# Altium project Kasli-DIOT.PrjPCB (part 4 of 7)

## Sheet FPGAGTP.SchDoc: Kasli-DIOT
size 420 x 297 mm; EDA_Number: ARTIQ; Projet: ARTIQ/SINARA; Author: G.Kasprowicz; CompanyName: WUT ISE; DrawnBy: F.Świtakowski; Organization: WUT ISE; Address1: PW ISE; Address2: Nowowiejska 15/19 00-665 Warsaw; Address3: gkasprow@gmail.com; DocumentNumber: 2; Revision: 1.0; SheetNumber: 3; SheetTotal: 16; ModifiedBy: -; CheckedDate: -; Title2: FPGAGTP; DivGrp: WUT ISE; Designer: F.Świtakowski; ModifiedDate: -; ProjectName: Sensor Box
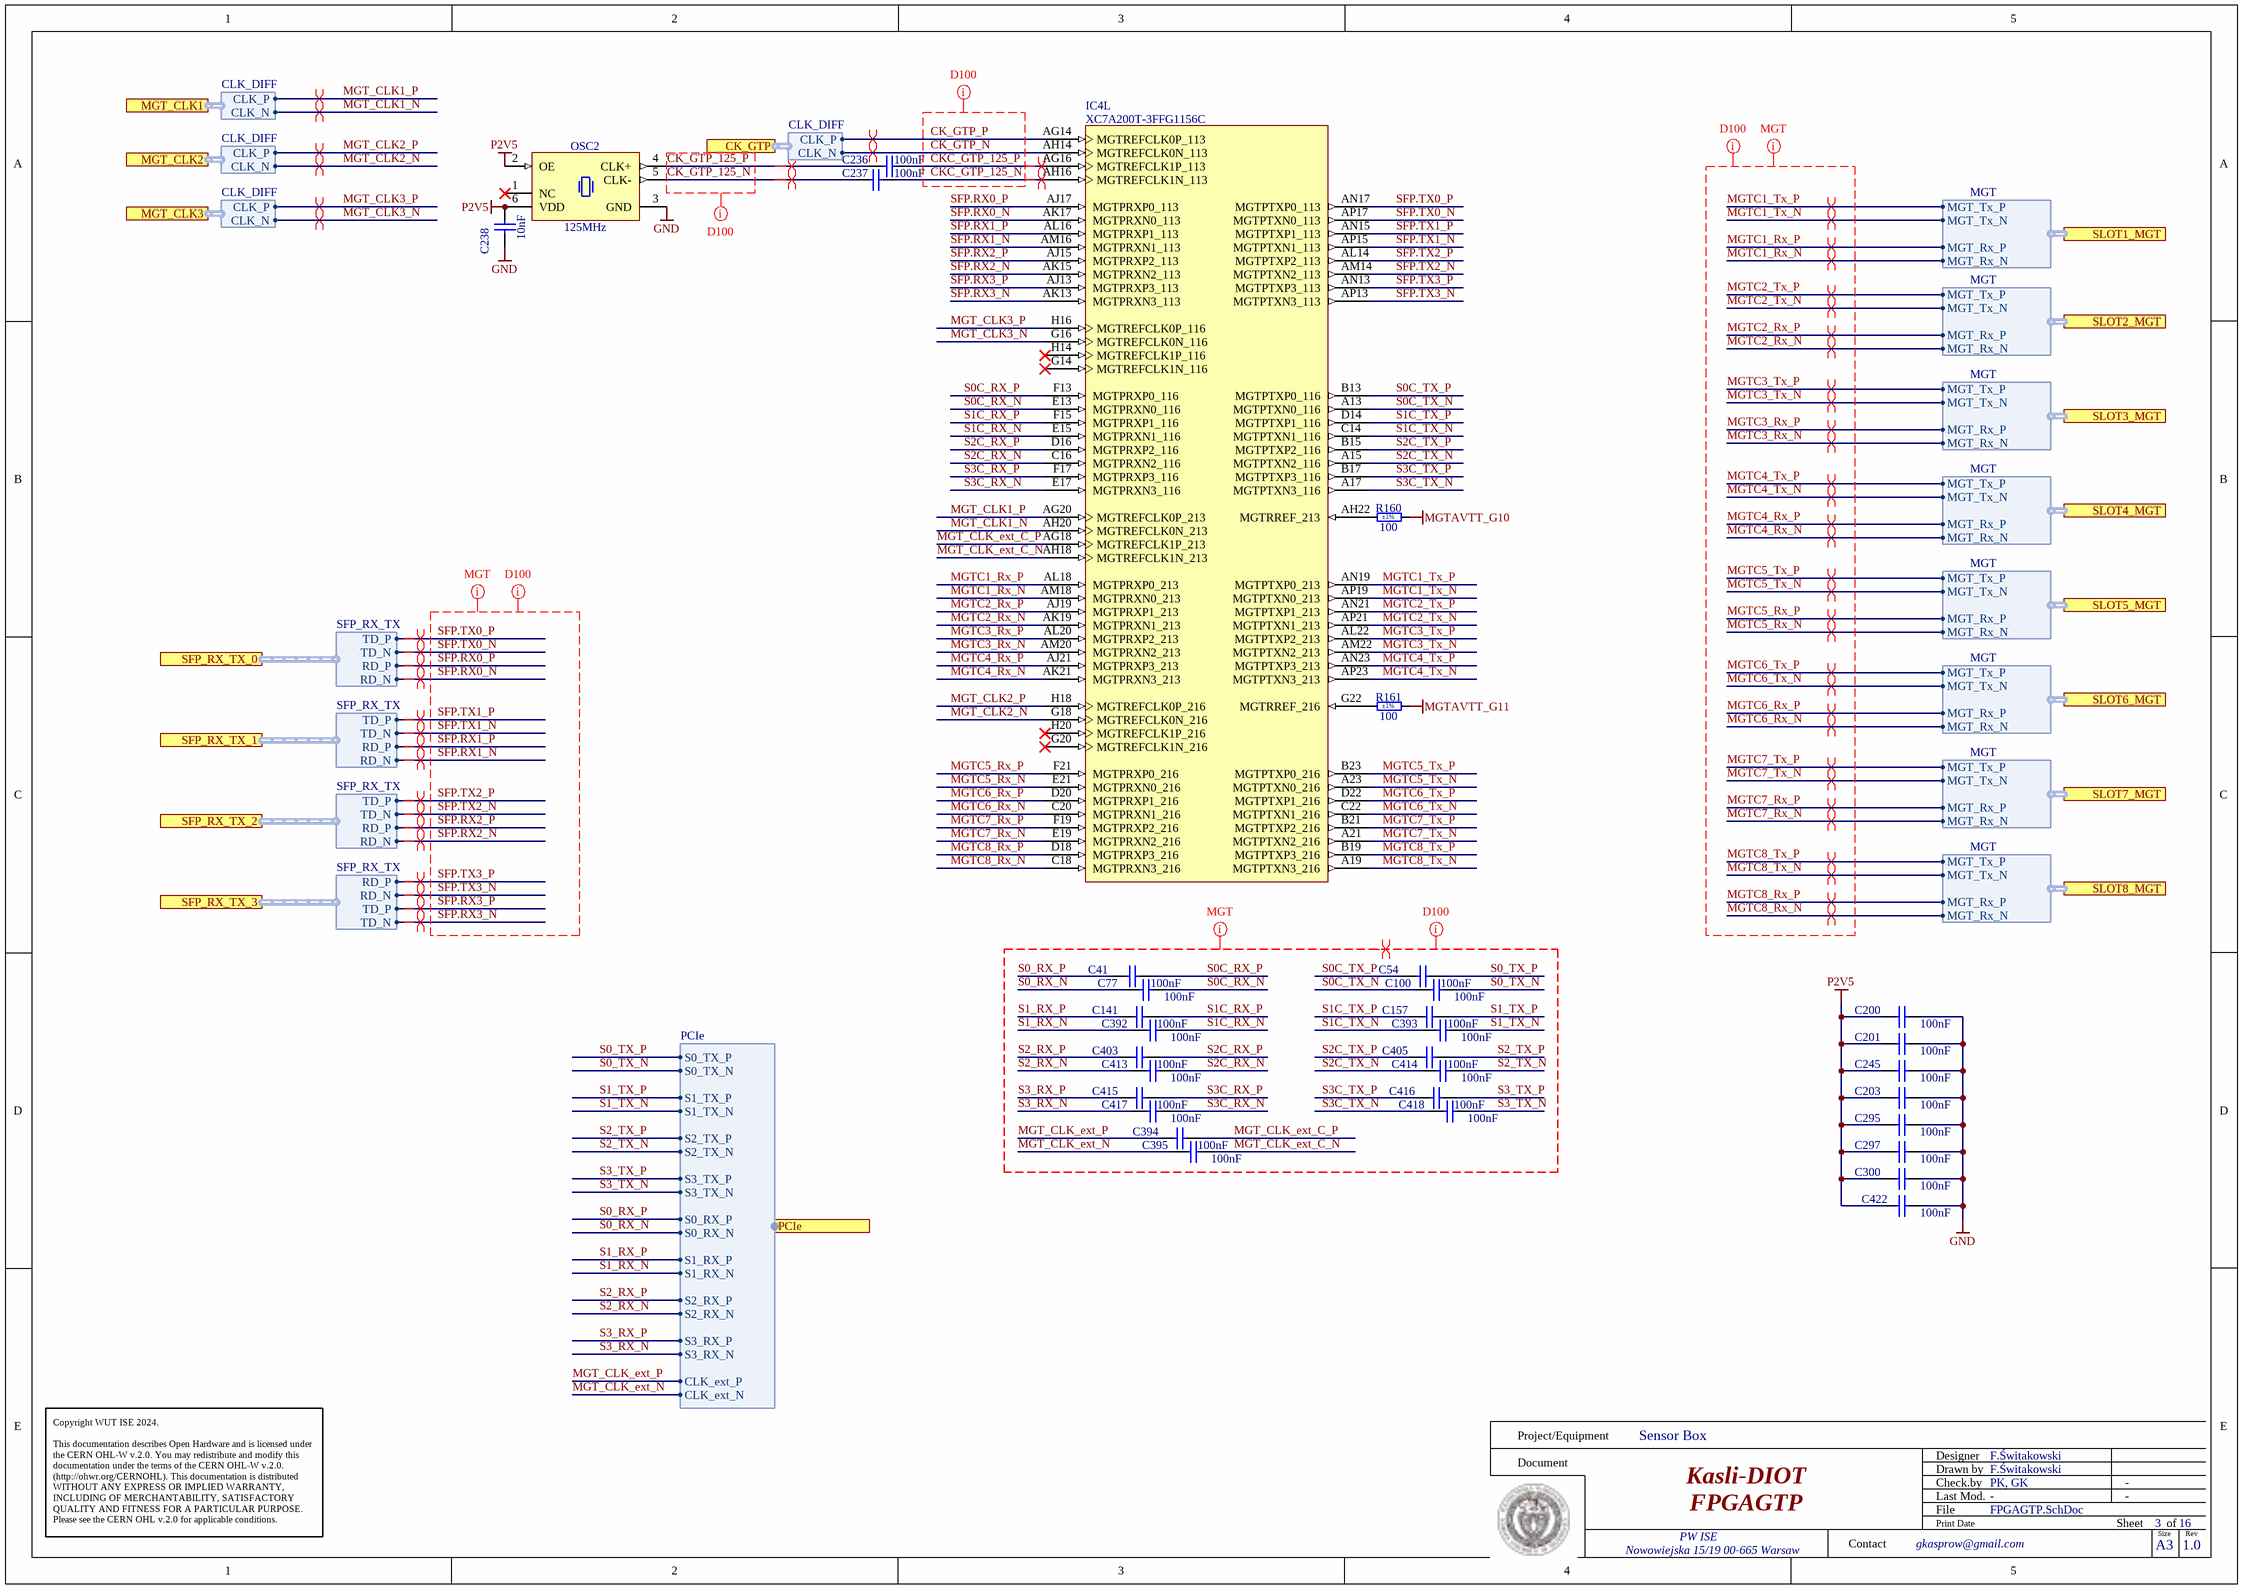
[diagram p4: FPGAGTP.SchDoc]

### Parts
C41  100nF  [CAPC0603X33N]
C54  100nF  [CAPC0603X33N]
C77  100nF  [CAPC0603X33N]
C100  100nF  [CAPC0603X33N]
C141  100nF  [CAPC0603X33N]
C157  100nF  [CAPC0603X33N]
C200  100nF  [CAPC0603X33N]
C201  100nF  [CAPC0603X33N]
C203  100nF  [CAPC0603X33N]
C236  100nF  [CAPC0603X33N]
C237  100nF  [CAPC0603X33N]
C238  10nF  [CAPC1005X55N]
C245  100nF  [CAPC0603X33N]
C295  100nF  [CAPC0603X33N]
C297  100nF  [CAPC0603X33N]
C300  100nF  [CAPC0603X33N]
C392  100nF  [CAPC0603X33N]
C393  100nF  [CAPC0603X33N]
C394  100nF  [CAPC0603X33N]
C395  100nF  [CAPC0603X33N]
C403  100nF  [CAPC0603X33N]
C405  100nF  [CAPC0603X33N]
C413  100nF  [CAPC0603X33N]
C414  100nF  [CAPC0603X33N]
C415  100nF  [CAPC0603X33N]
C416  100nF  [CAPC0603X33N]
C417  100nF  [CAPC0603X33N]
C418  100nF  [CAPC0603X33N]
C422  100nF  [CAPC0603X33N]
IC4  XC7A200T-3FFG1156C  [BGA1156C100P34X34_3500X3500X310]  (part L of 18)
OSC2  125MHz  [OSC_SILICON-LAB_SI510-6N]
R160  100  Tolerance: ±1%  [RESC0603X28N]
R161  100  Tolerance: ±1%  [RESC0603X28N]

### Ports
CK_GTP (harness CLK_DIFF), MGT_CLK1 (harness CLK_DIFF), MGT_CLK2 (harness CLK_DIFF), MGT_CLK3 (harness CLK_DIFF), PCIe (harness PCIe), SFP_RX_TX_0 (harness SFP_RX_TX), SFP_RX_TX_1 (harness SFP_RX_TX), SFP_RX_TX_2 (harness SFP_RX_TX), SFP_RX_TX_3 (harness SFP_RX_TX), SLOT1_MGT (harness MGT), SLOT2_MGT (harness MGT), SLOT3_MGT (harness MGT), SLOT4_MGT (harness MGT), SLOT5_MGT (harness MGT), SLOT6_MGT (harness MGT), SLOT7_MGT (harness MGT), SLOT8_MGT (harness MGT)

### Harnesses
SFP_RX_TX: RD_N, RD_P, TD_N, TD_P
MGT: MGT_Tx_P, MGT_Tx_N, MGT_Rx_P, MGT_Rx_N
CLK_DIFF: CLK_P, CLK_N
PCIe: S0_TX_P, S0_TX_N, S1_TX_P, S1_TX_N, S2_TX_P, S2_TX_N, S3_TX_P, S3_TX_N, S0_RX_P, S0_RX_N, S1_RX_P, S1_RX_N, S2_RX_P, S2_RX_N, S3_RX_P, S3_RX_N, CLK_ext_P, CLK_ext_N

### Nets
GND: C200.2 C201.2 C203.2 C238.1 C245.2 C295.2 C297.2 C300.2 C422.2 OSC2.3(GND)
MGTAVTT_G10: R160.2
MGTAVTT_G11: R161.2
P2V5: C200.1 C201.1 C203.1 C238.2 C245.1 C295.1 C297.1 C300.1 C422.1 OSC2.2(OE) OSC2.6(VDD)
CK_GTP_125_N: C237.1 OSC2.5(CLK-)
CK_GTP_125_P: C236.1 OSC2.4(CLK+)
CK_GTP_N: IC4.AH14(MGTREFCLK0N_113) ; port CK_GTP.CLK_N
CK_GTP_P: IC4.AG14(MGTREFCLK0P_113) ; port CK_GTP.CLK_P
CKC_GTP_125_N: C237.2 IC4.AH16(MGTREFCLK1N_113)
CKC_GTP_125_P: C236.2 IC4.AG16(MGTREFCLK1P_113)
MGT_CLK1_N: IC4.AH20(MGTREFCLK0N_213) ; port MGT_CLK1.CLK_N  [project net MGT_CLK1.CLK_N]
MGT_CLK1_P: IC4.AG20(MGTREFCLK0P_213) ; port MGT_CLK1.CLK_P  [project net MGT_CLK1.CLK_P]
MGT_CLK2_N: IC4.G18(MGTREFCLK0N_216) ; port MGT_CLK2.CLK_N  [project net MGT_CLK2.CLK_N]
MGT_CLK2_P: IC4.H18(MGTREFCLK0P_216) ; port MGT_CLK2.CLK_P  [project net MGT_CLK2.CLK_P]
MGT_CLK3_N: IC4.G16(MGTREFCLK0N_116) ; port MGT_CLK3.CLK_N  [project net MGT_CLK3.CLK_N]
MGT_CLK3_P: IC4.H16(MGTREFCLK0P_116) ; port MGT_CLK3.CLK_P  [project net MGT_CLK3.CLK_P]
MGT_CLK_ext_C_N: C395.2 IC4.AH18(MGTREFCLK1N_213)
MGT_CLK_ext_C_P: C394.2 IC4.AG18(MGTREFCLK1P_213)
MGT_CLK_ext_N: C395.1 ; port PCIe.CLK_ext_N
MGT_CLK_ext_P: C394.1 ; port PCIe.CLK_ext_P
MGTC1_Rx_N: IC4.AM18(MGTPRXN0_213) ; port SLOT1_MGT.MGT_Rx_N
MGTC1_Rx_P: IC4.AL18(MGTPRXP0_213) ; port SLOT1_MGT.MGT_Rx_P
MGTC1_Tx_N: IC4.AP19(MGTPTXN0_213) ; port SLOT1_MGT.MGT_Tx_N
MGTC1_Tx_P: IC4.AN19(MGTPTXP0_213) ; port SLOT1_MGT.MGT_Tx_P
MGTC2_Rx_N: IC4.AK19(MGTPRXN1_213) ; port SLOT2_MGT.MGT_Rx_N
MGTC2_Rx_P: IC4.AJ19(MGTPRXP1_213) ; port SLOT2_MGT.MGT_Rx_P
MGTC2_Tx_N: IC4.AP21(MGTPTXN1_213) ; port SLOT2_MGT.MGT_Tx_N
MGTC2_Tx_P: IC4.AN21(MGTPTXP1_213) ; port SLOT2_MGT.MGT_Tx_P
MGTC3_Rx_N: IC4.AM20(MGTPRXN2_213) ; port SLOT3_MGT.MGT_Rx_N
MGTC3_Rx_P: IC4.AL20(MGTPRXP2_213) ; port SLOT3_MGT.MGT_Rx_P
MGTC3_Tx_N: IC4.AM22(MGTPTXN2_213) ; port SLOT3_MGT.MGT_Tx_N
MGTC3_Tx_P: IC4.AL22(MGTPTXP2_213) ; port SLOT3_MGT.MGT_Tx_P
MGTC4_Rx_N: IC4.AK21(MGTPRXN3_213) ; port SLOT4_MGT.MGT_Rx_N
MGTC4_Rx_P: IC4.AJ21(MGTPRXP3_213) ; port SLOT4_MGT.MGT_Rx_P
MGTC4_Tx_N: IC4.AP23(MGTPTXN3_213) ; port SLOT4_MGT.MGT_Tx_N
MGTC4_Tx_P: IC4.AN23(MGTPTXP3_213) ; port SLOT4_MGT.MGT_Tx_P
MGTC5_Rx_N: IC4.E21(MGTPRXN0_216) ; port SLOT5_MGT.MGT_Rx_N
MGTC5_Rx_P: IC4.F21(MGTPRXP0_216) ; port SLOT5_MGT.MGT_Rx_P
MGTC5_Tx_N: IC4.A23(MGTPTXN0_216) ; port SLOT5_MGT.MGT_Tx_N
MGTC5_Tx_P: IC4.B23(MGTPTXP0_216) ; port SLOT5_MGT.MGT_Tx_P
MGTC6_Rx_N: IC4.C20(MGTPRXN1_216) ; port SLOT6_MGT.MGT_Rx_N
MGTC6_Rx_P: IC4.D20(MGTPRXP1_216) ; port SLOT6_MGT.MGT_Rx_P
MGTC6_Tx_N: IC4.C22(MGTPTXN1_216) ; port SLOT6_MGT.MGT_Tx_N
MGTC6_Tx_P: IC4.D22(MGTPTXP1_216) ; port SLOT6_MGT.MGT_Tx_P
MGTC7_Rx_N: IC4.E19(MGTPRXN2_216) ; port SLOT7_MGT.MGT_Rx_N
MGTC7_Rx_P: IC4.F19(MGTPRXP2_216) ; port SLOT7_MGT.MGT_Rx_P
MGTC7_Tx_N: IC4.A21(MGTPTXN2_216) ; port SLOT7_MGT.MGT_Tx_N
MGTC7_Tx_P: IC4.B21(MGTPTXP2_216) ; port SLOT7_MGT.MGT_Tx_P
MGTC8_Rx_N: IC4.C18(MGTPRXN3_216) ; port SLOT8_MGT.MGT_Rx_N
MGTC8_Rx_P: IC4.D18(MGTPRXP3_216) ; port SLOT8_MGT.MGT_Rx_P
MGTC8_Tx_N: IC4.A19(MGTPTXN3_216) ; port SLOT8_MGT.MGT_Tx_N
MGTC8_Tx_P: IC4.B19(MGTPTXP3_216) ; port SLOT8_MGT.MGT_Tx_P
S0_RX_N: C77.1 ; port PCIe.S0_RX_N
S0_RX_P: C41.1 ; port PCIe.S0_RX_P
S0_TX_N: C100.2 ; port PCIe.S0_TX_N
S0_TX_P: C54.2 ; port PCIe.S0_TX_P
S0C_RX_N: C77.2 IC4.E13(MGTPRXN0_116)
S0C_RX_P: C41.2 IC4.F13(MGTPRXP0_116)
S0C_TX_N: C100.1 IC4.A13(MGTPTXN0_116)
S0C_TX_P: C54.1 IC4.B13(MGTPTXP0_116)
S1_RX_N: C392.1 ; port PCIe.S1_RX_N
S1_RX_P: C141.1 ; port PCIe.S1_RX_P
S1_TX_N: C393.2 ; port PCIe.S1_TX_N
S1_TX_P: C157.2 ; port PCIe.S1_TX_P
S1C_RX_N: C392.2 IC4.E15(MGTPRXN1_116)
S1C_RX_P: C141.2 IC4.F15(MGTPRXP1_116)
S1C_TX_N: C393.1 IC4.C14(MGTPTXN1_116)
S1C_TX_P: C157.1 IC4.D14(MGTPTXP1_116)
S2_RX_N: C413.1 ; port PCIe.S2_RX_N
S2_RX_P: C403.1 ; port PCIe.S2_RX_P
S2_TX_N: C414.2 ; port PCIe.S2_TX_N
S2_TX_P: C405.2 ; port PCIe.S2_TX_P
S2C_RX_N: C413.2 IC4.C16(MGTPRXN2_116)
S2C_RX_P: C403.2 IC4.D16(MGTPRXP2_116)
S2C_TX_N: C414.1 IC4.A15(MGTPTXN2_116)
S2C_TX_P: C405.1 IC4.B15(MGTPTXP2_116)
S3_RX_N: C417.1 ; port PCIe.S3_RX_N
S3_RX_P: C415.1 ; port PCIe.S3_RX_P
S3_TX_N: C418.2 ; port PCIe.S3_TX_N
S3_TX_P: C416.2 ; port PCIe.S3_TX_P
S3C_RX_N: C417.2 IC4.E17(MGTPRXN3_116)
S3C_RX_P: C415.2 IC4.F17(MGTPRXP3_116)
S3C_TX_N: C418.1 IC4.A17(MGTPTXN3_116)
S3C_TX_P: C416.1 IC4.B17(MGTPTXP3_116)
SFP.RX0_N: IC4.AK17(MGTPRXN0_113) ; port SFP_RX_TX_0.RD_N
SFP.RX0_P: IC4.AJ17(MGTPRXP0_113) ; port SFP_RX_TX_0.RD_P
SFP.RX1_N: IC4.AM16(MGTPRXN1_113) ; port SFP_RX_TX_1.RD_N
SFP.RX1_P: IC4.AL16(MGTPRXP1_113) ; port SFP_RX_TX_1.RD_P
SFP.RX2_N: IC4.AK15(MGTPRXN2_113) ; port SFP_RX_TX_2.RD_N
SFP.RX2_P: IC4.AJ15(MGTPRXP2_113) ; port SFP_RX_TX_2.RD_P
SFP.RX3_N: IC4.AK13(MGTPRXN3_113) ; port SFP_RX_TX_3.TD_N
SFP.RX3_P: IC4.AJ13(MGTPRXP3_113) ; port SFP_RX_TX_3.TD_P
SFP.TX0_N: IC4.AP17(MGTPTXN0_113) ; port SFP_RX_TX_0.TD_N
SFP.TX0_P: IC4.AN17(MGTPTXP0_113) ; port SFP_RX_TX_0.TD_P
SFP.TX1_N: IC4.AP15(MGTPTXN1_113) ; port SFP_RX_TX_1.TD_N
SFP.TX1_P: IC4.AN15(MGTPTXP1_113) ; port SFP_RX_TX_1.TD_P
SFP.TX2_N: IC4.AM14(MGTPTXN2_113) ; port SFP_RX_TX_2.TD_N
SFP.TX2_P: IC4.AL14(MGTPTXP2_113) ; port SFP_RX_TX_2.TD_P
SFP.TX3_N: IC4.AP13(MGTPTXN3_113) ; port SFP_RX_TX_3.RD_N
SFP.TX3_P: IC4.AN13(MGTPTXP3_113) ; port SFP_RX_TX_3.RD_P
NetIC4_AH22: IC4.AH22(MGTRREF_213) R160.1
NetIC4_G22: IC4.G22(MGTRREF_216) R161.1

Not connected (* = marked no-connect by the designer): IC4 G14(MGTREFCLK1N_116)* G20(MGTREFCLK1N_216)* H14(MGTREFCLK1P_116)* H20(MGTREFCLK1P_216)*; OSC2 1(NC)*

### Layout directives
differential pair: CK_GTP_125_N, CK_GTP_125_P, CK_GTP_N, CK_GTP_P, CKC_GTP_125_N, CKC_GTP_125_P, MGT_CLK1.CLK_N, MGT_CLK1.CLK_P, MGT_CLK2.CLK_N, MGT_CLK2.CLK_P, MGT_CLK3.CLK_N, MGT_CLK3.CLK_P, MGT_CLK_ext_C_N, MGT_CLK_ext_C_P, MGT_CLK_ext_N, MGT_CLK_ext_P, MGTC1_Rx_N, MGTC1_Rx_P, MGTC1_Tx_N, MGTC1_Tx_P, MGTC2_Rx_N, MGTC2_Rx_P, MGTC2_Tx_N, MGTC2_Tx_P, MGTC3_Rx_N, MGTC3_Rx_P, MGTC3_Tx_N, MGTC3_Tx_P, MGTC4_Rx_N, MGTC4_Rx_P, MGTC4_Tx_N, MGTC4_Tx_P, MGTC5_Rx_N, MGTC5_Rx_P, MGTC5_Tx_N, MGTC5_Tx_P, MGTC6_Rx_N, MGTC6_Rx_P, MGTC6_Tx_N, MGTC6_Tx_P, MGTC7_Rx_N, MGTC7_Rx_P, MGTC7_Tx_N, MGTC7_Tx_P, MGTC8_Rx_N, MGTC8_Rx_P, MGTC8_Tx_N, MGTC8_Tx_P, S0_RX_N, S0_RX_P, S0_TX_N, S0_TX_P, S0C_RX_N, S0C_RX_P, S0C_TX_N, S0C_TX_P, S1_RX_N, S1_RX_P, S1_TX_N, S1_TX_P, S1C_RX_N, S1C_RX_P, S1C_TX_N, S1C_TX_P, S2_RX_N, S2_RX_P, S2_TX_N, S2_TX_P, S2C_RX_N, S2C_RX_P, S2C_TX_N, S2C_TX_P, S3_RX_N, S3_RX_P, S3_TX_N, S3_TX_P, S3C_RX_N, S3C_RX_P, S3C_TX_N, S3C_TX_P, SFP.RX0_N, SFP.RX0_P, SFP.RX1_N, SFP.RX1_P, SFP.RX2_N, SFP.RX2_P, SFP.RX3_N, SFP.RX3_P, SFP.TX0_N, SFP.TX0_P, SFP.TX1_N, SFP.TX1_P, SFP.TX2_N, SFP.TX2_P, SFP.TX3_N, SFP.TX3_P
net class MGT: MGT_CLK_ext_C_N, MGT_CLK_ext_C_P, MGT_CLK_ext_N, MGT_CLK_ext_P, MGTC1_Rx_N, MGTC1_Rx_P, MGTC1_Tx_N, MGTC1_Tx_P, MGTC2_Rx_N, MGTC2_Rx_P, MGTC2_Tx_N, MGTC2_Tx_P, MGTC3_Rx_N, MGTC3_Rx_P, MGTC3_Tx_N, MGTC3_Tx_P, MGTC4_Rx_N, MGTC4_Rx_P, MGTC4_Tx_N, MGTC4_Tx_P, MGTC5_Rx_N, MGTC5_Rx_P, MGTC5_Tx_N, MGTC5_Tx_P, MGTC6_Rx_N, MGTC6_Rx_P, MGTC6_Tx_N, MGTC6_Tx_P, MGTC7_Rx_N, MGTC7_Rx_P, MGTC7_Tx_N, MGTC7_Tx_P, MGTC8_Rx_N, MGTC8_Rx_P, MGTC8_Tx_N, MGTC8_Tx_P, S0_RX_N, S0_RX_P, S0_TX_N, S0_TX_P, S0C_RX_N, S0C_RX_P, S0C_TX_N, S0C_TX_P, S1_RX_N, S1_RX_P, S1_TX_N, S1_TX_P, S1C_RX_N, S1C_RX_P, S1C_TX_N, S1C_TX_P, S2_RX_N, S2_RX_P, S2_TX_N, S2_TX_P, S2C_RX_N, S2C_RX_P, S2C_TX_N, S2C_TX_P, S3_RX_N, S3_RX_P, S3_TX_N, S3_TX_P, S3C_RX_N, S3C_RX_P, S3C_TX_N, S3C_TX_P, SFP.RX0_N, SFP.RX0_P, SFP.RX1_N, SFP.RX1_P, SFP.RX2_N, SFP.RX2_P, SFP.RX3_N, SFP.RX3_P, SFP.TX0_N, SFP.TX0_P, SFP.TX1_N, SFP.TX1_P, SFP.TX2_N, SFP.TX2_P, SFP.TX3_N, SFP.TX3_P
net class D100: CK_GTP_125_N, CK_GTP_125_P, CK_GTP_N, CK_GTP_P, CKC_GTP_125_N, CKC_GTP_125_P, MGT_CLK_ext_C_N, MGT_CLK_ext_C_P, MGT_CLK_ext_N, MGT_CLK_ext_P, MGTC1_Rx_N, MGTC1_Rx_P, MGTC1_Tx_N, MGTC1_Tx_P, MGTC2_Rx_N, MGTC2_Rx_P, MGTC2_Tx_N, MGTC2_Tx_P, MGTC3_Rx_N, MGTC3_Rx_P, MGTC3_Tx_N, MGTC3_Tx_P, MGTC4_Rx_N, MGTC4_Rx_P, MGTC4_Tx_N, MGTC4_Tx_P, MGTC5_Rx_N, MGTC5_Rx_P, MGTC5_Tx_N, MGTC5_Tx_P, MGTC6_Rx_N, MGTC6_Rx_P, MGTC6_Tx_N, MGTC6_Tx_P, MGTC7_Rx_N, MGTC7_Rx_P, MGTC7_Tx_N, MGTC7_Tx_P, MGTC8_Rx_N, MGTC8_Rx_P, MGTC8_Tx_N, MGTC8_Tx_P, S0_RX_N, S0_RX_P, S0_TX_N, S0_TX_P, S0C_RX_N, S0C_RX_P, S0C_TX_N, S0C_TX_P, S1_RX_N, S1_RX_P, S1_TX_N, S1_TX_P, S1C_RX_N, S1C_RX_P, S1C_TX_N, S1C_TX_P, S2_RX_N, S2_RX_P, S2_TX_N, S2_TX_P, S2C_RX_N, S2C_RX_P, S2C_TX_N, S2C_TX_P, S3_RX_N, S3_RX_P, S3_TX_N, S3_TX_P, S3C_RX_N, S3C_RX_P, S3C_TX_N, S3C_TX_P, SFP.RX0_N, SFP.RX0_P, SFP.RX1_N, SFP.RX1_P, SFP.RX2_N, SFP.RX2_P, SFP.RX3_N, SFP.RX3_P, SFP.TX0_N, SFP.TX0_P, SFP.TX1_N, SFP.TX1_P, SFP.TX2_N, SFP.TX2_P, SFP.TX3_N, SFP.TX3_P

### Notes on the sheet
- Project/Equipment
- Document
- Designer
- Drawn by
- Check.by
- Copyright WUT ISE 2024.
  This documentation describes Open Hardware and is licensed under the CERN OHL-W v.2.0. You may redistribute and modify this documentation under the terms of the CERN OHL-W v.2.0. (http://ohwr.org/CERNOHL). This documentation is distributed WITHOUT ANY EXPRESS OR IMPLIED WARRANTY, INCLUDING OF MERCHANTABILITY, SATISFACTORY QUALITY AND FITNESS FOR A PARTICULAR PURPOSE. Please see the CERN OHL v.2.0 for applicable conditions.
- Contact
- File
- Last Mod.
- Print Date
- Sheet
- Size
- A3
- of
- Rev

### Library data of the parts
C41 C54 C77 C100 C141 C157 C200 C201 C203 C236 C237 C245 C295 C297 C300 C392-C395 C403 C405 C413-C418 C422 = CC0201_100NF_6.3V_10%_X5R: as C246-C257 on sheet SFP; Part Number: CC0201_100NF_6.3V_10%_X5R; Component Kind: Standard; Component Type: Standard; Pin Count: 2; Value: 100nF; Status: Not Recommended; Manufacturer Part Number: CC0201_100NF_6.3V_10%_X5R; Case: 0201; Mounted: Yes; Socket: No; SMD: Yes; Sense: No; Manufacturer1 Example: AVX; Manufacturer1 ComponentHeight: 0.33mm; HelpURL: \\cern.ch\dfs\Applications\Altium\Datasheets\CC0201_X5R_AVX.pdf; Author: CERN DEM JLC; CreateDate: 2007-12-03; LatestRevisionDate: 2007-12-03
C238 = CC0402_10NF_16V_10%_X7R: Non-polarised capacitor; Part Description: SMD Multilayer Chip Ceramic Capacitor; Manufacturer: GENERIC; Manufacturer1 Part Number: 223878715636; Voltage: 16V; TC: X7R; Tolerance: ±10%; Part Number: CC0402_10NF_16V_10%_X7R; Component Kind: Standard; Component Type: Standard; Pin Count: 2; Value: 10nF; Status: Not Recommended; Manufacturer Part Number: CC0402_10NF_16V_10%_X7R; Case: 0402; Mounted: Yes; Socket: No; SMD: Yes; Sense: No; Manufacturer1 Example: PHYCOMP; Manufacturer1 ComponentHeight: 0.55mm; HelpURL: \\cern.ch\dfs\Applications\Altium\Datasheets\CC0402_X7R_PHYCOMP.pdf; Author: CERN DEM JLC; CreateDate: 03.12.2007; LatestRevisionDate: 03.12.2007
IC4 = XC7A200T-3FFG1156C: Artix-7 FPGA, 500 User I/Os, 16 GTP, 1156-Ball BGA, , Speed Grade 3, Commercial Grade, Pb-Free; Part Description: Artix-7 FPGA, 500 User I/Os, 16 GTP, 1156-Ball BGA, Speed Grade 3, Commercial Grade, Pb-Free; Manufacturer: XILINX; PressFit: No; Bonding: No; Part Number: XC7A200T-3FFG1156C; Component Kind: Standard; Component Type: Standard; Device: XC7A200T-3FFG1156C; PackageDescription: BGA, 1.00mm Pitch, Square; 1156 Pin, 34 Columns X 34 Rows, Body 35.00mm X 35.0mm X 3.10mm H, IPC Medium Density; Manufacturer Part Number: XC7A200T-3FFG1156C; Pin Count: 1156; Case: BGA1156; Mounted: Yes; Socket: No; SMD: Yes; Sense: No; ComponentHeight: 3.1mm; HelpURL: \\cern.ch\dfs\Applications\Altium\Datasheets\XC7A200T-3FFG1156C.pdf; ComponentLink1URL: \\cern.ch\dfs\Applications\Altium\Datasheets\XC7A200T-3FFG1156C_Package.pdf; ComponentLink1Description: Package; ComponentLink2URL: \\cern.ch\dfs\Applications\Altium\Datasheets\XC7A200T-3FFG1156C_Pinout.txt; ComponentLink2Description: Pinout; Author: CERN DEM JLC; CreateDate: 07.11.2016; LatestRevisionDate: 07.11.2016
OSC2 = OSC_125MHZ_SILICON-LAB_510FBA125M000AAG: Crystal Oscillator 6 pins, Si510 (LVDS/LVPECL/HCSL/Dual CMOS); Part Description: 2.5V ±25ppm LVDS Crystal Oscillator (XO), Si510 Series; Manufacturer: SILICON LABS; PressFit: No; Bonding: No; Part Number: OSC_125MHZ_SILICON-LAB_510FBA125M000AAG; Component Kind: Standard; Component Type: Standard; PackageDescription: Oscillator Si510 Series, 6 pins, 5x7mm; Value: 125MHz; Manufacturer Part Number: 510FBA125M000AAG; Pin Count: 6; Mounted: Yes; Socket: No; SMD: Yes; Sense: No; ComponentHeight: 1.8mm; HelpURL: \\cern.ch\dfs\Applications\Altium\Datasheets\OSC_SILICON-LAB_SI510.pdf; Author: CERN DEM JMW; CreateDate: 2015-08-10; LatestRevisionDate: 2015-08-10
R160 R161 = R0201_100R_1%_0.05W_200PPM: Resistor - 1%; Part Description: Thick Film Chip Resistor; Manufacturer: GENERIC; Manufacturer1 Part Number: CRCW0201100RFNED; Power: 0.05W; TC: ±200ppm/°C; PressFit: No; Part Number: R0201_100R_1%_0.05W_200PPM; Component Kind: Standard; Component Type: Standard; Pin Count: 2; Value: 100; Status: Not Recommended; Manufacturer Part Number: R0201_100R_1%_0.05W_200PPM; Case: 0201; Mounted: Yes; Sense: No; Socket: No; SMD: Yes; Manufacturer1 Example: VISHAY; Manufacturer1 ComponentHeight: 0.27mm; HelpURL: \\cern.ch\dfs\Applications\Altium\Datasheets\R0201_VISHAY_CRCW e3.pdf; Author: CERN DEM JLC; CreateDate: 13.11.2014; LatestRevisionDate: 13.11.2014

## Sheet FPGA_I2C.SchDoc: Kasli-DIOT
size 420 x 297 mm; EDA_Number: ARTIQ; Projet: ARTIQ/SINARA; Author: G.Kasprowicz; CompanyName: WUT ISE; DrawnBy: F.Świtakowski; Organization: WUT ISE; Address1: PW ISE; Address2: Nowowiejska 15/19 00-665 Warsaw; Address3: gkasprow@gmail.com; DocumentNumber: 6; Revision: 1.0; SheetNumber: 7; SheetTotal: 16; ModifiedBy: -; CheckedDate: -; Title2: FPGA_I2C; DivGrp: WUT ISE; Designer: F.Świtakowski; ModifiedDate: -; ProjectName: Sensor Box
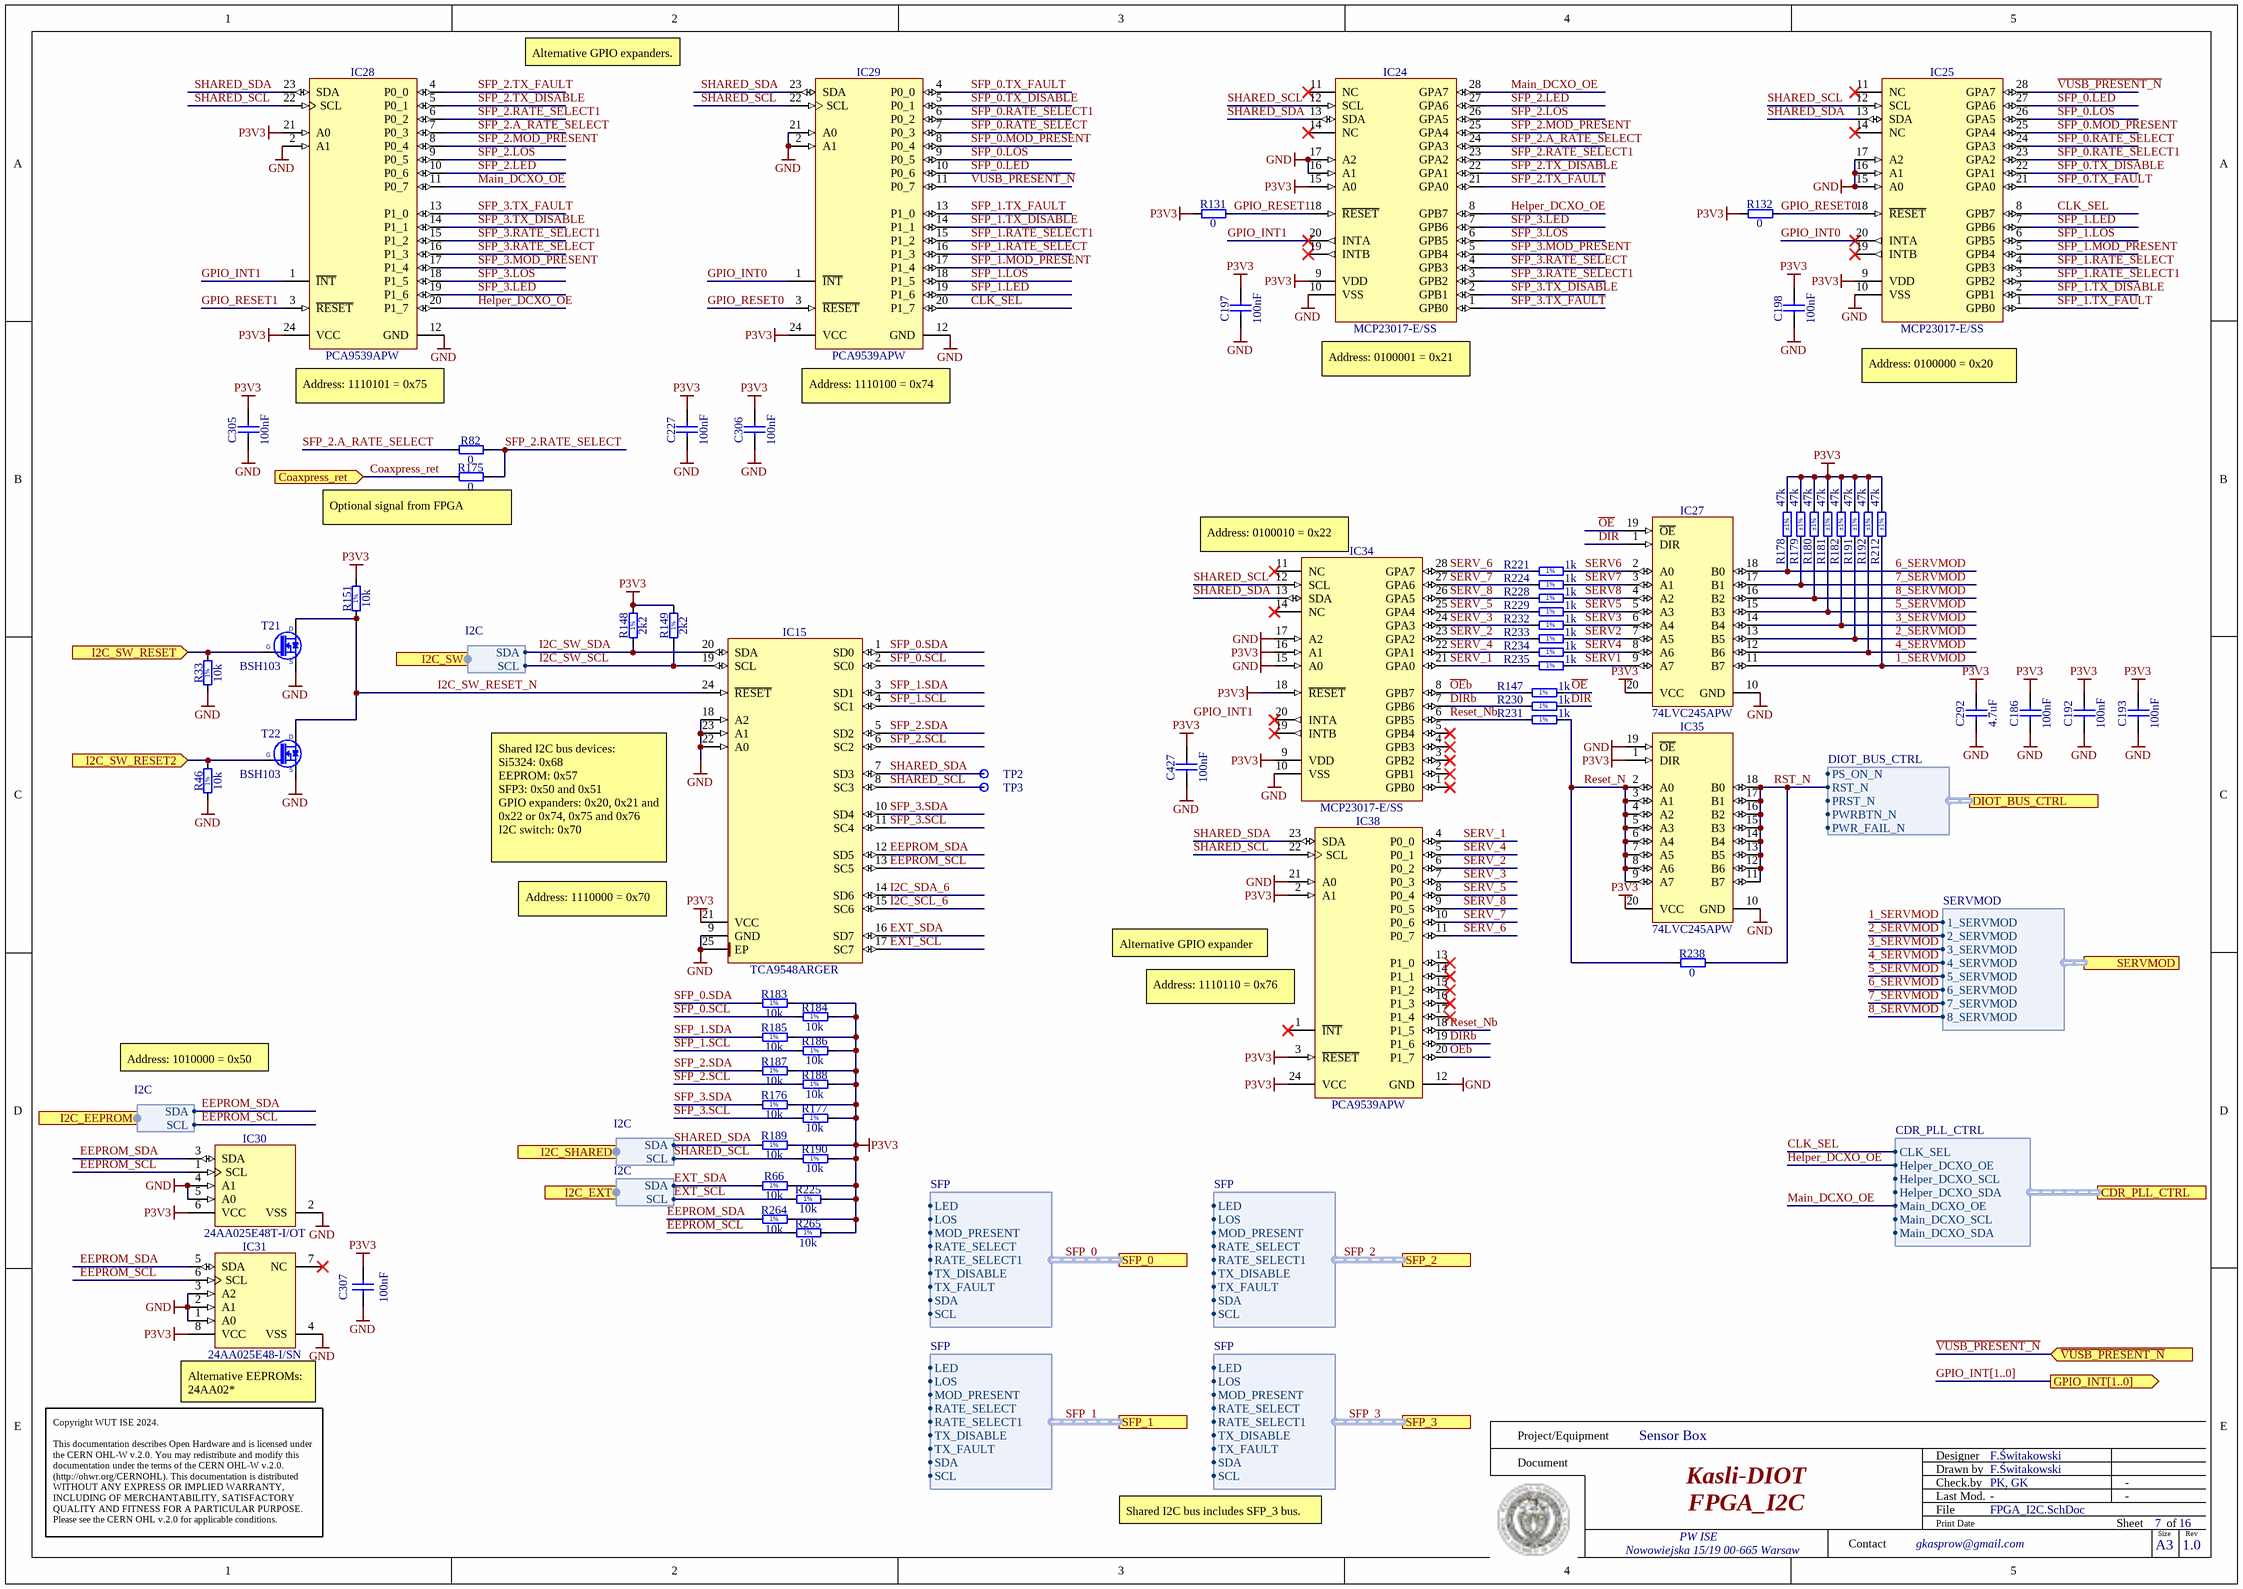
[diagram p5: FPGA_I2C.SchDoc]

### Parts
C186  100nF  [CAPC1005X55N]
C192  100nF  [CAPC1005X55N]
C193  100nF  [CAPC1005X55N]
C197  100nF  [CAPC1005X55N]
C198  100nF  [CAPC1005X55N]
C227  100nF  [CAPC1005X55N]
C292  4.7uF  [CAPC1005X55N]
C305  100nF  [CAPC1005X55N]
C306  100nF  [CAPC1005X55N]
C307  100nF  [CAPC1005X55N]
C427  100nF  [CAPC1005X55N]
IC15  TCA9548ARGER  [QFN50P400X400X100-25N-S220]
IC24  MCP23017-E/SS  [SOP65P780X200-28N]
IC25  MCP23017-E/SS  [SOP65P780X200-28N]
IC27  74LVC245APW  [SOP65P640X110-20N]
IC28  PCA9539APW  [SOP65P640X110-24N]
IC29  PCA9539APW  [SOP65P640X110-24N]
IC30  24AA025E48T-I/OT  [SOT95P280X145-6N]
IC31  24AA025E48-I/SN  [SOIC127P600X175-8N]
IC34  MCP23017-E/SS  [SOP65P780X200-28N]
IC35  74LVC245APW  [SOP65P640X110-20N]
IC38  PCA9539APW  [SOP65P640X110-24N]
R33  10k  [RESC1005X40N]
R46  10k  [RESC1005X40N]
R66  10k  [RESC1005X40N]
R82  0  [RESC1005X40N]
R131  0  [RESC1005X40N]
R132  0  [RESC1005X40N]
R147  1k  [RESC1005X40N]
R148  2k2  [RESC1005X40N]
R149  2k2  [RESC1005X40N]
R151  10k  [RESC1005X40N]
R175  0  [RESC1005X40N]
R176  10k  [RESC1005X40N]
R177  10k  [RESC1005X40N]
R178  47k  Tolerance: ±1%  [RESC1005X40N]
R179  47k  Tolerance: ±1%  [RESC1005X40N]
R180  47k  Tolerance: ±1%  [RESC1005X40N]
R181  47k  Tolerance: ±1%  [RESC1005X40N]
R182  47k  Tolerance: ±1%  [RESC1005X40N]
R183  10k  [RESC1005X40N]
R184  10k  [RESC1005X40N]
R185  10k  [RESC1005X40N]
R186  10k  [RESC1005X40N]
R187  10k  [RESC1005X40N]
R188  10k  [RESC1005X40N]
R189  10k  [RESC1005X40N]
R190  10k  [RESC1005X40N]
R191  47k  Tolerance: ±1%  [RESC1005X40N]
R192  47k  Tolerance: ±1%  [RESC1005X40N]
R212  47k  Tolerance: ±1%  [RESC1005X40N]
R221  1k  [RESC1005X40N]
R224  1k  [RESC1005X40N]
R225  10k  [RESC1005X40N]
R228  1k  [RESC1005X40N]
R229  1k  [RESC1005X40N]
R230  1k  [RESC1005X40N]
R231  1k  [RESC1005X40N]
R232  1k  [RESC1005X40N]
R233  1k  [RESC1005X40N]
R234  1k  [RESC1005X40N]
R235  1k  [RESC1005X40N]
R238  0  [RESC1005X40N]
R264  10k  [RESC1005X40N]
R265  10k  [RESC1005X40N]
T21  BSH103  [SOT95P230X110-3N]
T22  BSH103  [SOT95P230X110-3N]
TP2  Test Point  [TPS127]  (value not drawn)  (no BOM)
TP3  Test Point  [TPS127]  (value not drawn)  (no BOM)

### Ports
CDR_PLL_CTRL (harness CDR_PLL_CTRL), Coaxpress_ret (in), DIOT_BUS_CTRL (harness DIOT_BUS_CTRL), GPIO_INT[1..0] (out), I2C_EEPROM (harness i2C), I2C_EXT (harness i2C), I2C_SHARED (harness i2C), I2C_SW (harness i2C), I2C_SW_RESET2 (in), I2C_SW_RESET (in), SERVMOD (harness SERVMOD), SFP_0 (harness SFP), SFP_1 (harness SFP), SFP_2 (harness SFP), SFP_3 (harness SFP), ~{VUSB_PRESENT_N} (in)

### Harnesses
SFP: LED, LOS, MOD_PRESENT, RATE_SELECT, RATE_SELECT1, TX_DISABLE, TX_FAULT, SDA, SCL
CDR_PLL_CTRL: CLK_SEL, Helper_DCXO_OE, Helper_DCXO_SCL, Helper_DCXO_SDA, Main_DCXO_OE, Main_DCXO_SCL, Main_DCXO_SDA
SERVMOD: 5_SERVMOD, 6_SERVMOD, 2_SERVMOD, 7_SERVMOD, 3_SERVMOD, 4_SERVMOD, 1_SERVMOD, 8_SERVMOD
DIOT_BUS_CTRL: PS_ON_N, RST_N, PRST_N, PWRBTN_N, PWR_FAIL_N
I2C: SDA, SCL

### Nets
GND: C186.1 C192.1 C193.1 C197.1 C198.1 C227.1 C292.1 C305.1 C306.1 C307.1 C427.1 IC15.9(GND) IC15.18(A2) IC15.22(A0) IC15.23(A1) IC15.25(EP) IC24.10(VSS) IC24.16(A1) IC24.17(A2) IC25.10(VSS) IC25.15(A0) IC25.16(A1) IC25.17(A2) IC27.10(GND) IC28.2(A1) IC28.12(GND) IC29.2(A1) IC29.12(GND) IC29.21(A0) IC30.2(VSS) IC30.4(A1) IC30.5(A0) IC31.1(A0) IC31.2(A1) IC31.3(A2) IC31.4(VSS) IC34.10(VSS) IC34.15(A0) IC34.17(A2) IC35.10(GND) IC35.19(~{OE}) IC38.12(GND) IC38.21(A0) R33.1 R46.1 T21.2(S) T22.2(S)
P3V3: C186.2 C192.2 C193.2 C197.2 C198.2 C227.2 C292.2 C305.2 C306.2 C307.2 C427.2 IC15.21(VCC) IC24.9(VDD) IC24.15(A0) IC25.9(VDD) IC27.20(VCC) IC28.21(A0) IC28.24(VCC) IC29.24(VCC) IC30.6(VCC) IC31.8(VCC) IC34.9(VDD) IC34.16(A1) IC34.18(~{RESET}) IC35.1(DIR) IC35.20(VCC) IC38.2(A1) IC38.3(~{RESET}) IC38.24(VCC) R66.2 R131.1 R132.1 R148.2 R149.2 R151.2 R176.2 R177.2 R178.2 R179.2 R180.2 R181.2 R182.2 R183.2 R184.2 R185.2 R186.2 R187.2 R188.2 R189.2 R190.2 R191.2 R192.2 R212.2 R225.2 R264.2 R265.2
1_SERVMOD: IC27.11(B7) R212.1 ; port SERVMOD.1_SERVMOD
2_SERVMOD: IC27.13(B5) R191.1 ; port SERVMOD.2_SERVMOD
3_SERVMOD: IC27.14(B4) R182.1 ; port SERVMOD.3_SERVMOD
4_SERVMOD: IC27.12(B6) R192.1 ; port SERVMOD.4_SERVMOD
5_SERVMOD: IC27.15(B3) R181.1 ; port SERVMOD.5_SERVMOD
6_SERVMOD: IC27.18(B0) R178.1 ; port SERVMOD.6_SERVMOD
7_SERVMOD: IC27.17(B1) R179.1 ; port SERVMOD.7_SERVMOD
8_SERVMOD: IC27.16(B2) R180.1 ; port SERVMOD.8_SERVMOD
~{VUSB_PRESENT_N}: IC25.28(GPA7) IC29.11(P0_7) ; port ~{VUSB_PRESENT_N}
CLK_SEL: IC25.8(GPB7) IC29.20(P1_7) ; port CDR_PLL_CTRL.CLK_SEL
Coaxpress_ret: R175.1 ; port Coaxpress_ret
DIR: IC27.1(DIR) R230.2
DIRb: IC34.7(GPB6) IC38.19(P1_6) R230.1
EEPROM_SCL: IC15.13(SC5) IC30.1(SCL) IC31.6(SCL) R265.1 ; port I2C_EEPROM.SCL
EEPROM_SDA: IC15.12(SD5) IC30.3(SDA) IC31.5(SDA) R264.1 ; port I2C_EEPROM.SDA
EXT_SCL: IC15.17(SC7) R225.1 ; port I2C_EXT.SCL
EXT_SDA: IC15.16(SD7) R66.1 ; port I2C_EXT.SDA
GPIO_INT0: IC25.20(INTA) IC29.1(~{INT})
GPIO_INT1: IC24.20(INTA) IC28.1(~{INT})
GPIO_RESET0: IC25.18(~{RESET}) IC29.3(~{RESET}) R132.2
GPIO_RESET1: IC24.18(~{RESET}) IC28.3(~{RESET}) R131.2
Helper_DCXO_OE: IC24.8(GPB7) IC28.20(P1_7) ; port CDR_PLL_CTRL.Helper_DCXO_OE
I2C_SCL_6: IC15.15(SC6)
I2C_SDA_6: IC15.14(SD6)
I2C_SW_RESET: R33.2 T21.1(G) ; port I2C_SW_RESET
I2C_SW_RESET2: R46.2 T22.1(G) ; port I2C_SW_RESET2
I2C_SW_RESET_N: IC15.24(~{RESET}) R151.1 T21.3(D) T22.3(D)
I2C_SW_SCL: IC15.19(SCL) R149.1 ; port I2C_SW.SCL
I2C_SW_SDA: IC15.20(SDA) R148.1 ; port I2C_SW.SDA
Main_DCXO_OE: IC24.28(GPA7) IC28.11(P0_7) ; port CDR_PLL_CTRL.Main_DCXO_OE
~{OE}: IC27.19(~{OE}) R147.2
~{OE}b: IC34.8(GPB7) IC38.20(P1_7) R147.1
Reset_N: IC35.2(A0) IC35.3(A1) IC35.4(A2) IC35.5(A3) IC35.6(A4) IC35.7(A5) IC35.8(A6) IC35.9(A7) R231.2 R238.1
Reset_Nb: IC34.6(GPB5) IC38.18(P1_5) R231.1
RST_N: IC35.11(B7) IC35.12(B6) IC35.13(B5) IC35.14(B4) IC35.15(B3) IC35.16(B2) IC35.17(B1) IC35.18(B0) R238.2 ; port DIOT_BUS_CTRL.RST_N  [project net DIOT_BUS_CTRL.RST_N]
SERV1: IC27.9(A7) R235.2
SERV2: IC27.7(A5) R233.2
SERV3: IC27.6(A4) R232.2
SERV4: IC27.8(A6) R234.2
SERV5: IC27.5(A3) R229.2
SERV6: IC27.2(A0) R221.2
SERV7: IC27.3(A1) R224.2
SERV8: IC27.4(A2) R228.2
SERV_1: IC34.21(GPA0) IC38.4(P0_0) R235.1
SERV_2: IC34.23(GPA2) IC38.6(P0_2) R233.1
SERV_3: IC34.24(GPA3) IC38.7(P0_3) R232.1
SERV_4: IC34.22(GPA1) IC38.5(P0_1) R234.1
SERV_5: IC34.25(GPA4) IC38.8(P0_4) R229.1
SERV_6: IC34.28(GPA7) IC38.11(P0_7) R221.1
SERV_7: IC34.27(GPA6) IC38.10(P0_6) R224.1
SERV_8: IC34.26(GPA5) IC38.9(P0_5) R228.1
SFP_0.LED: IC25.27(GPA6) IC29.10(P0_6)
SFP_0.LOS: IC25.26(GPA5) IC29.9(P0_5)
SFP_0.MOD_PRESENT: IC25.25(GPA4) IC29.8(P0_4)
SFP_0.RATE_SELECT: IC25.24(GPA3) IC29.7(P0_3)
SFP_0.RATE_SELECT1: IC25.23(GPA2) IC29.6(P0_2)
SFP_0.SCL: IC15.2(SC0) R184.1
SFP_0.SDA: IC15.1(SD0) R183.1
SFP_0.TX_DISABLE: IC25.22(GPA1) IC29.5(P0_1)
SFP_0.TX_FAULT: IC25.21(GPA0) IC29.4(P0_0)
SFP_1.LED: IC25.7(GPB6) IC29.19(P1_6)
SFP_1.LOS: IC25.6(GPB5) IC29.18(P1_5)
SFP_1.MOD_PRESENT: IC25.5(GPB4) IC29.17(P1_4)
SFP_1.RATE_SELECT: IC25.4(GPB3) IC29.16(P1_3)
SFP_1.RATE_SELECT1: IC25.3(GPB2) IC29.15(P1_2)
SFP_1.SCL: IC15.4(SC1) R186.1
SFP_1.SDA: IC15.3(SD1) R185.1
SFP_1.TX_DISABLE: IC25.2(GPB1) IC29.14(P1_1)
SFP_1.TX_FAULT: IC25.1(GPB0) IC29.13(P1_0)
SFP_2.A_RATE_SELECT: IC24.24(GPA3) IC28.7(P0_3) R82.1
SFP_2.LED: IC24.27(GPA6) IC28.10(P0_6)
SFP_2.LOS: IC24.26(GPA5) IC28.9(P0_5)
SFP_2.MOD_PRESENT: IC24.25(GPA4) IC28.8(P0_4)
SFP_2.RATE_SELECT: R82.2 R175.2
SFP_2.RATE_SELECT1: IC24.23(GPA2) IC28.6(P0_2)
SFP_2.SCL: IC15.6(SC2) R188.1
SFP_2.SDA: IC15.5(SD2) R187.1
SFP_2.TX_DISABLE: IC24.22(GPA1) IC28.5(P0_1)
SFP_2.TX_FAULT: IC24.21(GPA0) IC28.4(P0_0)
SFP_3.LED: IC24.7(GPB6) IC28.19(P1_6)
SFP_3.LOS: IC24.6(GPB5) IC28.18(P1_5)
SFP_3.MOD_PRESENT: IC24.5(GPB4) IC28.17(P1_4)
SFP_3.RATE_SELECT: IC24.4(GPB3) IC28.16(P1_3)
SFP_3.RATE_SELECT1: IC24.3(GPB2) IC28.15(P1_2)
SFP_3.SCL: IC15.11(SC4) R177.1
SFP_3.SDA: IC15.10(SD4) R176.1
SFP_3.TX_DISABLE: IC24.2(GPB1) IC28.14(P1_1)
SFP_3.TX_FAULT: IC24.1(GPB0) IC28.13(P1_0)
SHARED_SCL: IC15.8(SC3) IC24.12(SCL) IC25.12(SCL) IC28.22(SCL) IC29.22(SCL) IC34.12(SCL) IC38.22(SCL) R190.1 TP3.1 ; port I2C_SHARED.SCL
SHARED_SDA: IC15.7(SD3) IC24.13(SDA) IC25.13(SDA) IC28.23(SDA) IC29.23(SDA) IC34.13(SDA) IC38.23(SDA) R189.1 TP2.1 ; port I2C_SHARED.SDA

Not connected (* = marked no-connect by the designer): IC24 11(NC)* 14(NC)* 19(INTB)*; IC25 11(NC)* 14(NC)* 19(INTB)*; IC31 7(NC)*; IC34 1(GPB0)* 2(GPB1)* 3(GPB2)* 4(GPB3)* 5(GPB4)* 11(NC)* 14(NC)* 19(INTB)* 20(INTA)*; IC38 1(~{INT})* 13(P1_0)* 14(P1_1)* 15(P1_2)* 16(P1_3)* 17(P1_4)*

### Buses and harness runs
bus GPIO_INT[1..0] = port GPIO_INT[1..0]
harness SFP_0 = port SFP_0
harness SFP_1 = port SFP_1
harness SFP_2 = port SFP_2
harness SFP_3 = port SFP_3

### Notes on the sheet
- Alternative GPIO expanders.
- Address: 1110101 = 0x75
- Address: 1110100 = 0x74
- (near IC24) Address: 0100001 = 0x21
- (near IC25) Address: 0100000 = 0x20
- (near R175) Optional signal from FPGA
- (near IC34) Address: 0100010 = 0x22
- Shared I2C bus devices:
  Si5324: 0x68
  EEPROM: 0x57
  SFP3: 0x50 and 0x51
  GPIO expanders: 0x20, 0x21 and 0x22 or 0x74, 0x75 and 0x76
  I2C switch: 0x70
- Address: 1110000 = 0x70
- (near IC38) Alternative GPIO expander
- (near IC38) Address: 1110110 = 0x76
- Address: 1010000 = 0x50
- (near IC31) Alternative EEPROMs:
  24AA02*
- Shared I2C bus includes SFP_3 bus.
- Labels drawn without touching a wire or pin: GPIO_INT1
- Project/Equipment
- Document
- Designer
- Drawn by
- Check.by
- Copyright WUT ISE 2024.
  This documentation describes Open Hardware and is licensed under the CERN OHL-W v.2.0. You may redistribute and modify this documentation under the terms of the CERN OHL-W v.2.0. (http://ohwr.org/CERNOHL). This documentation is distributed WITHOUT ANY EXPRESS OR IMPLIED WARRANTY, INCLUDING OF MERCHANTABILITY, SATISFACTORY QUALITY AND FITNESS FOR A PARTICULAR PURPOSE. Please see the CERN OHL v.2.0 for applicable conditions.
- Contact
- File
- Last Mod.
- Print Date
- Sheet
- Size
- A3
- of
- Rev
- (in symbol R0402_1K_1%_0.0625W_100PPM) 1%
- (in symbol R0402_2K2_1%_0.0625W_100PPM) 1%
- (in symbol R0402_10K_1%_0.0625W_100PPM) 1%

### Library data of the parts
C186 C192 C193 C197 C198 C227 C305 C306 C427 = CC0402_100NF_16V_10%_X7R: Non-polarised capacitor; Part Description: SMD Multilayer Chip Ceramic Capacitor; Manufacturer: GENERIC; Manufacturer1 Part Number: GRM155R71C104KA88D; Voltage: 16V; TC: X7R; Tolerance: ±10%; Part Number: CC0402_100NF_16V_10%_X7R; Component Kind: Standard; Component Type: Standard; Pin Count: 2; Value: 100nF; Status: Not Recommended; Manufacturer Part Number: CC0402_100NF_16V_10%_X7R; Case: 0402; Mounted: Yes; Socket: No; SMD: Yes; Sense: No; Manufacturer1 Example: MURATA; Manufacturer1 ComponentHeight: 0.55mm; HelpURL: \\cern.ch\dfs\Applications\Altium\Datasheets\CC0402_X7R_MURATA_GRM.pdf; Author: CERN DEM JLC; CreateDate: 05/12/2013; LatestRevisionDate: 03/12/2007
C292 = CC0402_4.7UF_6.3V_20%_X5R: Non-polarised capacitor; Part Description: SMD Multilayer Chip Ceramic Capacitor; Manufacturer: GENERIC; Manufacturer1 Part Number: C1005X5R0J475M050BC; Voltage: 6.3V; TC: X5R; Tolerance: ±20%; Part Number: CC0402_4.7UF_6.3V_20%_X5R; Component Kind: Standard; Component Type: Standard; Pin Count: 2; Value: 4.7uF; Status: Preferred; Manufacturer Part Number: CC0402_4.7UF_6.3V_20%_X5R; Case: 0402; Mounted: Yes; Socket: No; SMD: Yes; Sense: No; Manufacturer1 Example: TDK; Manufacturer1 ComponentHeight: 0.65mm; HelpURL: \\cern.ch\dfs\Applications\Altium\Datasheets\CC0402_X5R_TDK_C.pdf; Author: CERN DEM JLC; CreateDate: 03/03/2015; LatestRevisionDate: 03/03/2015
C307 = CC0402_100NF_16V_10%_X5R: Non-polarised capacitor; Part Description: SMD Multilayer Chip Ceramic Capacitor; Manufacturer: GENERIC; Manufacturer1 Part Number: GRM155R61C104KA88D; Voltage: 16V; TC: X5R; Tolerance: ±10%; Part Number: CC0402_100NF_16V_10%_X5R; Component Kind: Standard; Component Type: Standard; Pin Count: 2; Value: 100nF; Status: None; Manufacturer Part Number: CC0402_100NF_16V_10%_X5R; Case: 0402; Mounted: Yes; Socket: No; SMD: Yes; Sense: No; Manufacturer1 Example: MURATA; Manufacturer1 ComponentHeight: 0.55mm; HelpURL: \\cern.ch\dfs\Applications\Altium\Datasheets\CC0402_X5R_MURATA_GRM.pdf; Author: CERN DEM JLC; CreateDate: 2013-12-10; LatestRevisionDate: 2013-12-10
IC15 = TCA9548ARGER: Low Voltage 8-Channel I2C Switch With Reset; Manufacturer: TEXAS INSTRUMENTS; PressFit: No; Bonding: No; Part Number: TCA9548ARGER; Component Kind: Standard; Component Type: Standard; Device: TCA9548ARGER; PackageDescription: QFN, 0.50mm Pitch, Square; 24 Pin, 4.00mm L X 4.00mm W X 1.00mm H body (w/thermal tab 2.2 X 2.2mm), IPC Medium Density; Part Description: Low Voltage 8-Channel I2C Switch With Reset; Manufacturer Part Number: TCA9548ARGER; Pin Count: 25; Case: QFN24; Mounted: Yes; Socket: No; SMD: Yes; Sense: No; ComponentHeight: 1mm; Author: CERN DEM JLC; HelpURL: \\cern.ch\dfs\Applications\Altium\Datasheets\TCA9548ARGER.pdf; CreateDate: 07.07.2014; LatestRevisionDate: 07.07.2014
IC24 IC25 IC34 = MCP23017-E/SS: 16-bit I/O Port Expander With Serial Interface; Manufacturer: MICROCHIP TECHNOLOGY; PressFit: No; Bonding: No; Part Number: MCP23017-E/SS; Component Kind: Standard; Component Type: Standard; Device: MCP23017-E/SS; PackageDescription: SOP, 0.65mm Pitch; 28 pin, 5.30mm W X 10.20mm L X 2.00mm H body, IPC Medium Density; Part Description: 16-bit I/O Port Expander With Serial Interface; Manufacturer Part Number: MCP23017-E/SS; Pin Count: 28; Case: SSOP28; Mounted: Yes; Socket: No; SMD: Yes; Sense: No; ComponentHeight: 2mm; Author: CERN DEM JLC; HelpURL: \\cern.ch\dfs\Applications\Altium\Datasheets\MCP23017-E-SS.pdf; CreateDate: 2011-01-17; LatestRevisionDate: 2011-01-17
IC27 IC35 = 74HC245PW: Octal Bi-Directional Transceiver with 3-State Inputs/Outputs; Part Description: Octal Bus Transceiver; 3-State; Manufacturer: NXP SEMICONDUCTORS; PressFit: No; Bonding: No; Part Number: 74LVC245APW; Component Kind: Standard; Component Type: Standard; Device: 74LVC245APW; PackageDescription: SOP, 20-Leads, Body 6.6x4.5mm (max), Pitch 0.65mm, IPC Medium Density; Manufacturer Part Number: 74LVC245APW; Pin Count: 20; Case: TSSOP20; Mounted: Yes; Socket: No; SMD: Yes; Sense: No; ComponentHeight: 1.1mm; Author: CERN DEM MR; HelpURL: \\cern.ch\dfs\Applications\Altium\Datasheets\74HC245PW.pdf; CreateDate: 04.02.2016; LatestRevisionDate: 04.02.2016
IC28 IC29 IC38 = PCA9539APW: Low-Voltage 16-Bit I2C-Bus I/O Port with Interrupt and Reset; Manufacturer: NXP SEMICONDUCTORS; PressFit: No; Bonding: No; Part Number: PCA9539APW; Component Kind: Standard; Component Type: Standard; Device: PCA9539APW; PackageDescription: SOP, 0.65mm Pitch; 24 Pin, 4.40mm W X 7.80mm L X 1.10mm H body, IPC Medium Density; Part Description: Low-Voltage 16-Bit I2C-Bus I/O Port with Interrupt and Reset; Manufacturer Part Number: PCA9539APW; Pin Count: 24; Case: TSSOP24; Mounted: Yes; Socket: No; SMD: Yes; Sense: No; ComponentHeight: 1.1mm; Author: CERN DEM JMW; HelpURL: \\cern.ch\dfs\Applications\Altium\Datasheets\PCA9539APW.pdf; CreateDate: 2020-08-06; LatestRevisionDate: 2020-08-06
IC30 = 24AA025E48T-I/OT: 1.7V-5.5V, 2K I2C Serial EEPROM With EUI-48 Node Identity; Part Description: 1.7V-5.5V, 2K I2C Serial EEPROM With EUI-48™ Node Identity; Cascadable; Manufacturer: MICROCHIP TECHNOLOGY; PressFit: No; Bonding: No; Part Number: 24AA025E48T-I/OT; Component Kind: Standard; Component Type: Standard; Device: 24AA025E48T-I/OT; PackageDescription: SOT, 0.95mm pitch; 6 pin, 1.60mm W X 2.90mm L X 1.45mm H body, IPC Medium Density; Manufacturer Part Number: 24AA025E48T-I/OT; Pin Count: 6; Case: SOT23-6; Mounted: Yes; Socket: No; SMD: Yes; Sense: No; ComponentHeight: 1.45mm; HelpURL: \\cern.ch\dfs\Applications\Altium\Datasheets\24AA025E48T-I-OT.pdf; Author: CERN DEM BC; CreateDate: 2019-12-06; LatestRevisionDate: 2019-12-06
IC31 = 24AA025E48-I/SN: 1.7V-5.5V, 2K I2C™ Serial EEPROMs with EUI-48™ Node Identity; Manufacturer: MICROCHIP TECHNOLOGY; PressFit: No; Bonding: No; Part Number: 24AA025E48-I/SN; Component Kind: Standard; Component Type: Standard; Device: 24AA025E48-I/SN; PackageDescription: SOIC, 1.27mm Pitch; 8 Pin - Body 4x5mm, IPC Medium Density; Part Description: 1.7V-5.5V, 2K I2C™ Serial EEPROMs with EUI-48™ Node Identity; Manufacturer Part Number: 24AA025E48-I/SN; Pin Count: 8; Case: SOIC8; Mounted: Yes; Socket: No; SMD: Yes; Sense: No; ComponentHeight: 1.75mm; HelpURL: \\cern.ch\dfs\Applications\Altium\Datasheets\24AA025E48-I-SN.pdf; Author: CERN DEM MR; CreateDate: 2016-07-19; LatestRevisionDate: 2016-07-19
R33 R46 R66 R151 R176 R177 R183-R190 R225 R264 R265 = R0402_10K_1%_0.0625W_100PPM: Resistor - 1%; Part Description: General Purpose Thick Film Chip Resistor; Manufacturer: GENERIC; Manufacturer1 Part Number: 232270671003L; TC: ±100ppm/°C; PressFit: No; Part Number: R0402_10K_1%_0.0625W_100PPM; Component Kind: Standard; Component Type: Standard; Pin Count: 2; Value: 10k; Status: Not Recommended; Power: 0.0625W; Tolerance: ±1%; Manufacturer Part Number: R0402_10K_1%_0.0625W_100PPM; Case: 0402; Mounted: Yes; Sense: No; Socket: No; SMD: Yes; Manufacturer1 Example: YAGEO PHYCOMP; Manufacturer1 ComponentHeight: 0.4mm; HelpURL: \\cern.ch\dfs\Applications\Altium\Datasheets\R0402_Phycomp_RC0402.pdf; Author: CERN DEM JLC; CreateDate: 03.12.2007; LatestRevisionDate: 17.10.2012
R82 R131 R132 R175 R238 = R0402_0R_JUMPER: Resistor; Part Description: 1A (0.05R Max DC Resistance) Zero Ohm Jumper; Manufacturer: GENERIC; Manufacturer1 Part Number: 232270591001L; PressFit: No; Part Number: R0402_0R_JUMPER; Component Kind: Standard; Component Type: Standard; Pin Count: 2; Value: 0; Status: Not Recommended; Manufacturer Part Number: R0402_0R_JUMPER; Case: 0402; Mounted: Yes; Sense: No; Socket: No; SMD: Yes; Manufacturer1 Example: YAGEO PHYCOMP; Manufacturer1 ComponentHeight: 0.4mm; HelpURL: \\cern.ch\dfs\Applications\Altium\Datasheets\R0402_Phycomp_RC0402.pdf; Author: CERN DEM JLC
  R82 R175 R238: CreateDate: 03.12.2007; LatestRevisionDate: 17.10.2012
  R131 R132: CreateDate: 2007-12-03; LatestRevisionDate: 2012-10-17
R147 R221 R224 R228-R235 = R0402_1K_1%_0.0625W_100PPM: Resistor - 1%; Part Description: General Purpose Thick Film Chip Resistor; Manufacturer: GENERIC; Manufacturer1 Part Number: 232270671002L; TC: ±100ppm/°C; PressFit: No; Part Number: R0402_1K_1%_0.0625W_100PPM; Component Kind: Standard; Component Type: Standard; Pin Count: 2; Value: 1k; Status: Not Recommended; Power: 0.0625W; Tolerance: ±1%; Manufacturer Part Number: R0402_1K_1%_0.0625W_100PPM; Case: 0402; Mounted: Yes; Sense: No; Socket: No; SMD: Yes; Manufacturer1 Example: YAGEO PHYCOMP; Manufacturer1 ComponentHeight: 0.4mm; HelpURL: \\cern.ch\dfs\Applications\Altium\Datasheets\R0402_Phycomp_RC0402.pdf; Author: CERN DEM JLC; CreateDate: 03.12.2007; LatestRevisionDate: 17.10.2012; ClassName: Artix
R148 R149 = R0402_2K2_1%_0.0625W_100PPM: Resistor - 1%; Part Description: General Purpose Thick Film Chip Resistor; Manufacturer: GENERIC; Manufacturer1 Part Number: 232270672202L; TC: ±100ppm/°C; PressFit: No; Part Number: R0402_2K2_1%_0.0625W_100PPM; Component Kind: Standard; Component Type: Standard; Pin Count: 2; Value: 2k2; Status: Not Recommended; Power: 0.0625W; Tolerance: ±1%; Manufacturer Part Number: R0402_2K2_1%_0.0625W_100PPM; Case: 0402; Mounted: Yes; Sense: No; Socket: No; SMD: Yes; Manufacturer1 Example: YAGEO PHYCOMP; Manufacturer1 ComponentHeight: 0.4mm; HelpURL: \\cern.ch\dfs\Applications\Altium\Datasheets\R0402_Phycomp_RC0402.pdf; Author: CERN DEM JLC; CreateDate: 03.12.2007; LatestRevisionDate: 17.10.2012
R178-R182 R191 R192 R212 = R0402_47K_1%_0.0625W_100PPM: Resistor - 1%; Part Description: General Purpose Thick Film Chip Resistor; Manufacturer: GENERIC; Manufacturer1 Part Number: 232270674703L; TC: ±100ppm/°C; PressFit: No; Part Number: R0402_47K_1%_0.0625W_100PPM; Component Kind: Standard; Component Type: Standard; Pin Count: 2; Value: 47k; Status: Not Recommended; Power: 0.0625W; Manufacturer Part Number: R0402_47K_1%_0.0625W_100PPM; Case: 0402; Mounted: Yes; Sense: No; Socket: No; SMD: Yes; Manufacturer1 Example: YAGEO PHYCOMP; Manufacturer1 ComponentHeight: 0.4mm; HelpURL: \\cern.ch\dfs\Applications\Altium\Datasheets\R0402_Phycomp_RC0402.pdf; Author: CERN DEM JLC; CreateDate: 03.12.2007; LatestRevisionDate: 17.10.2012
T21 T22 = BSH103: N-CHANNEL MOSFET WITH DIODE; Part Description: 30V 850mA N-Channel Enhancement Mode Field-Effect Transistor; Manufacturer: NEXPERIA; PressFit: No; Bonding: No; Part Number: BSH103; Component Kind: Standard; Component Type: Standard; Device: BSH103; PackageDescription: SOT23, 3 pin, Pitch 0.95mm - 1.3mm W X 2.9mm L X 1.1mm H, IPC Medium Density; Manufacturer Part Number: BSH103; Pin Count: 3; Case: SOT23-3; Mounted: Yes; Socket: No; SMD: Yes; Sense: No; ComponentHeight: 1.1mm; HelpURL: \\cern.ch\dfs\Applications\Altium\Datasheets\BSH103.pdf; Author: CERN DEM JLC; CreateDate: 16.03.2010; LatestRevisionDate: 20.06.2017; ClassName: Artix
TP2 TP3 = SMD_PAD_1.27X1.27MM: Part Description: 1.27mm x 1.27mm PCB Copper Area (SMD Test Point); Mounted: No; Part Number: SMD_PAD_1.27X1.27MM; Component Type: Standard (No BOM); Pin Count: 1; Family: Test Point; Socket: No; SMD: Yes; Sense: No; Status: None; ComponentHeight: 0mm; HelpURL: Undefined; Author: CERN DEM JLC; CreateDate: 12.01.2008; LatestRevisionDate: 12.01.2008; PackageDescription: 1.27mm x 1.27mm PCB Copper Area (SMD Test Point)